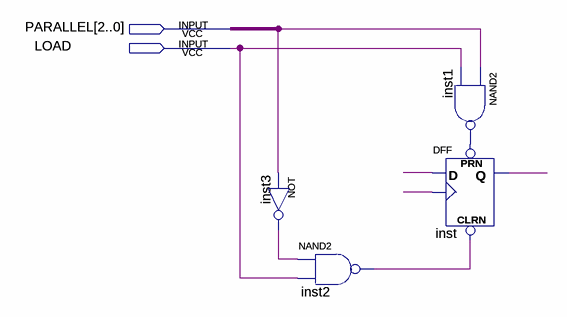
[diagram p0: schematic sheet]
// Quartus schematic REGISTRADOR.bdf as structural Verilog: 8 symbols, 4 pins
module REGISTRADOR (
  input  [2:0] PARALLEL,
  input  LOAD
);

  wire inst1_out, inst2_out, inst3_out, inst_q, undriven, undriven_2, undriven_3;

  not inst3 (inst3_out, undriven);
  not inst3_dup2 (inst3_out, undriven);
  nand inst2 (inst2_out, inst3_out, LOAD);
  nand inst2_dup2 (inst2_out, inst3_out, LOAD);
  nand inst1 (inst1_out, undriven, LOAD);
  nand inst1_dup2 (inst1_out, undriven, LOAD);
  DFF inst (.CLRN(inst2_out), .CLK(undriven_3), .D(undriven_2), .PRN(inst1_out), .Q(inst_q));
  DFF inst_dup2 (.CLRN(inst2_out), .CLK(undriven_3), .D(undriven_2), .PRN(inst1_out), .Q(inst_q));
endmodule
